# EAGLE schematic cpu (EAGLE 8.0.0)

## Sheet 1 of 3: Main Computer
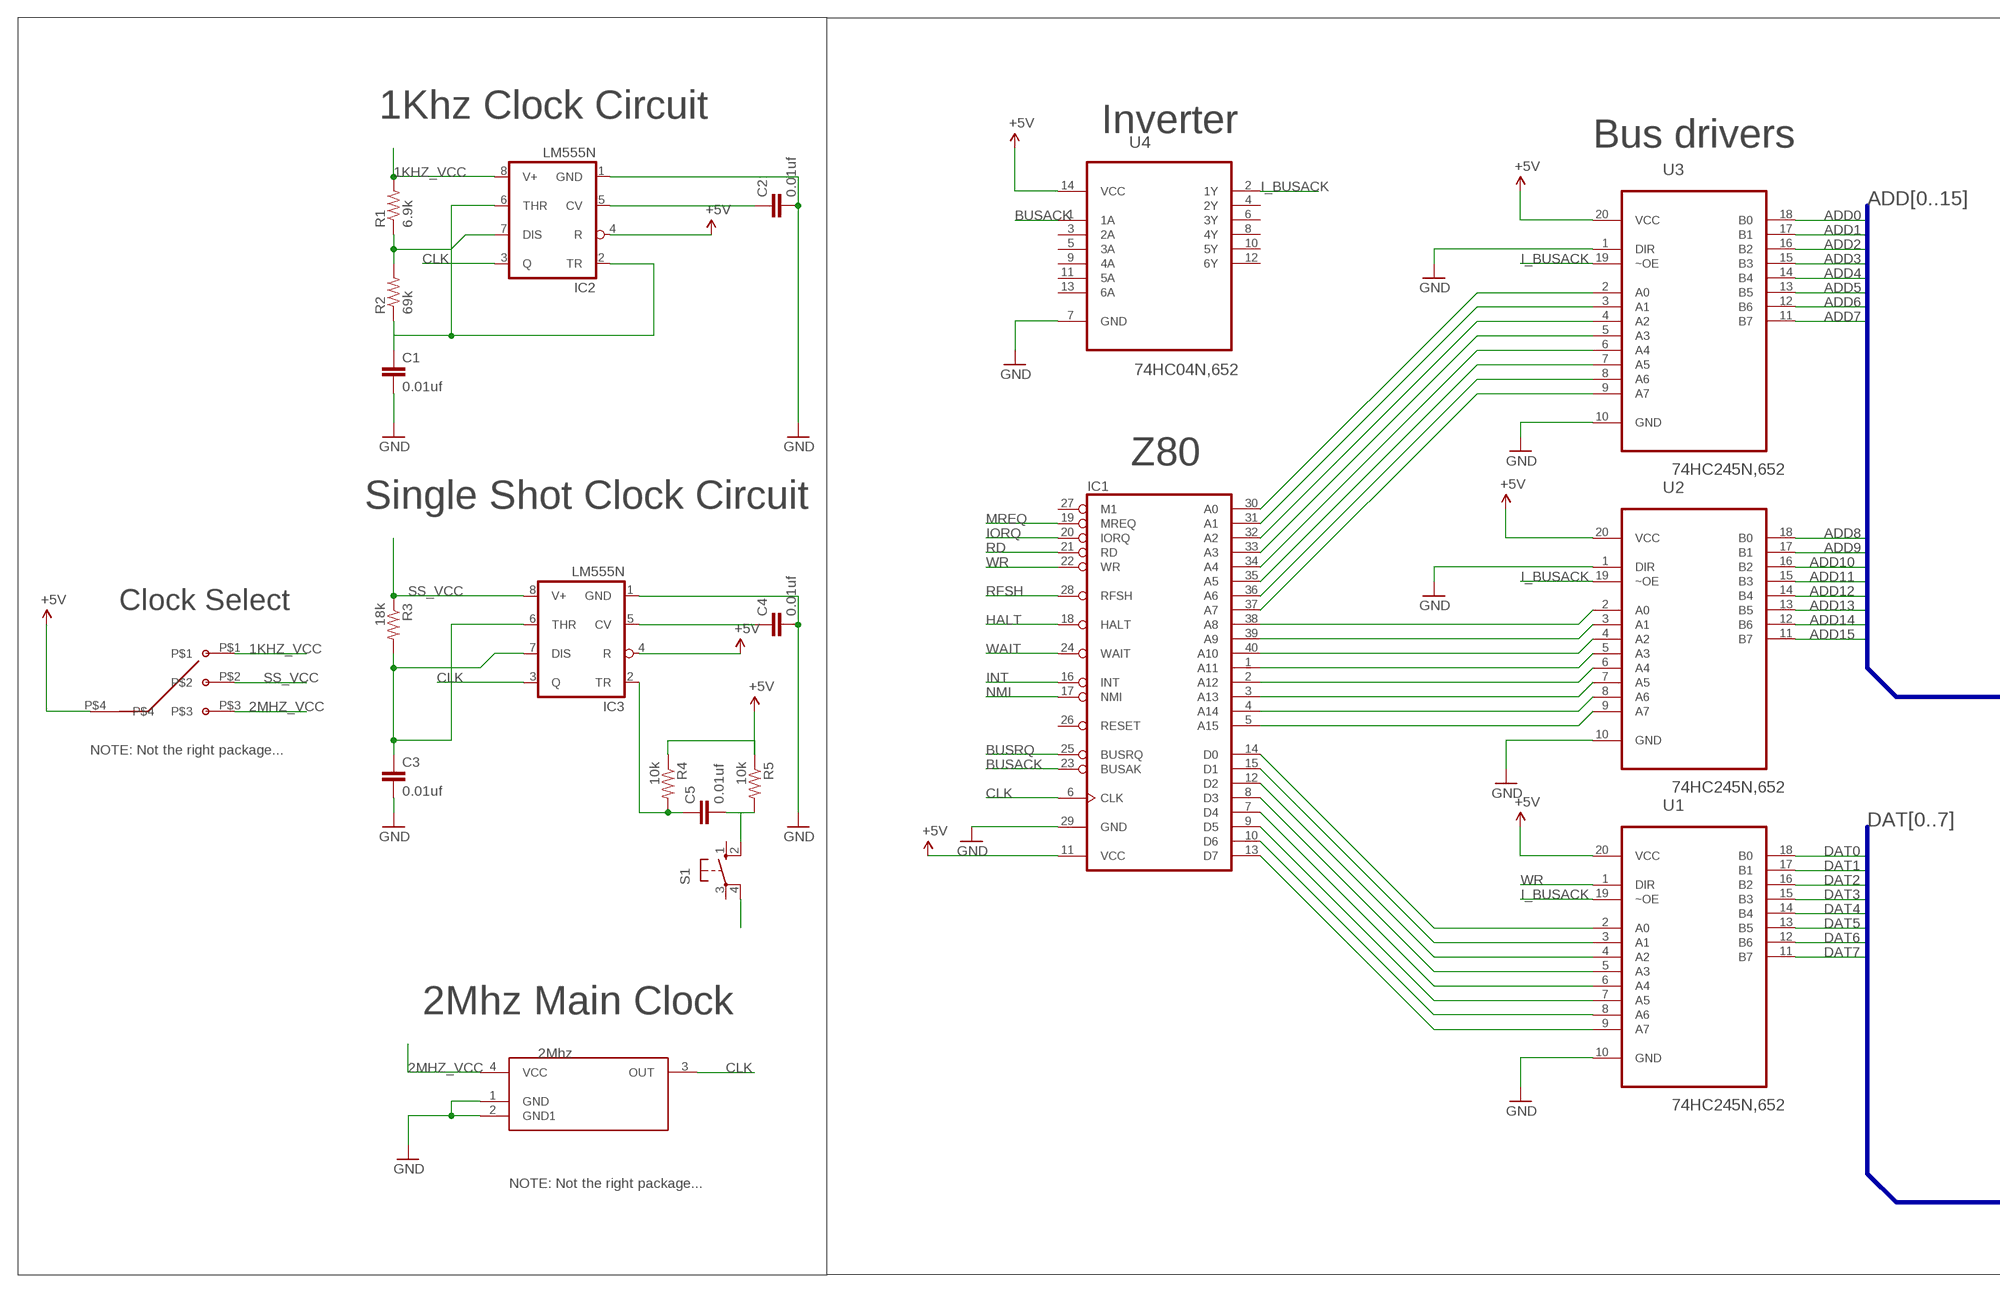
[diagram p0: schematic, sheet 1, part 1 of 2]
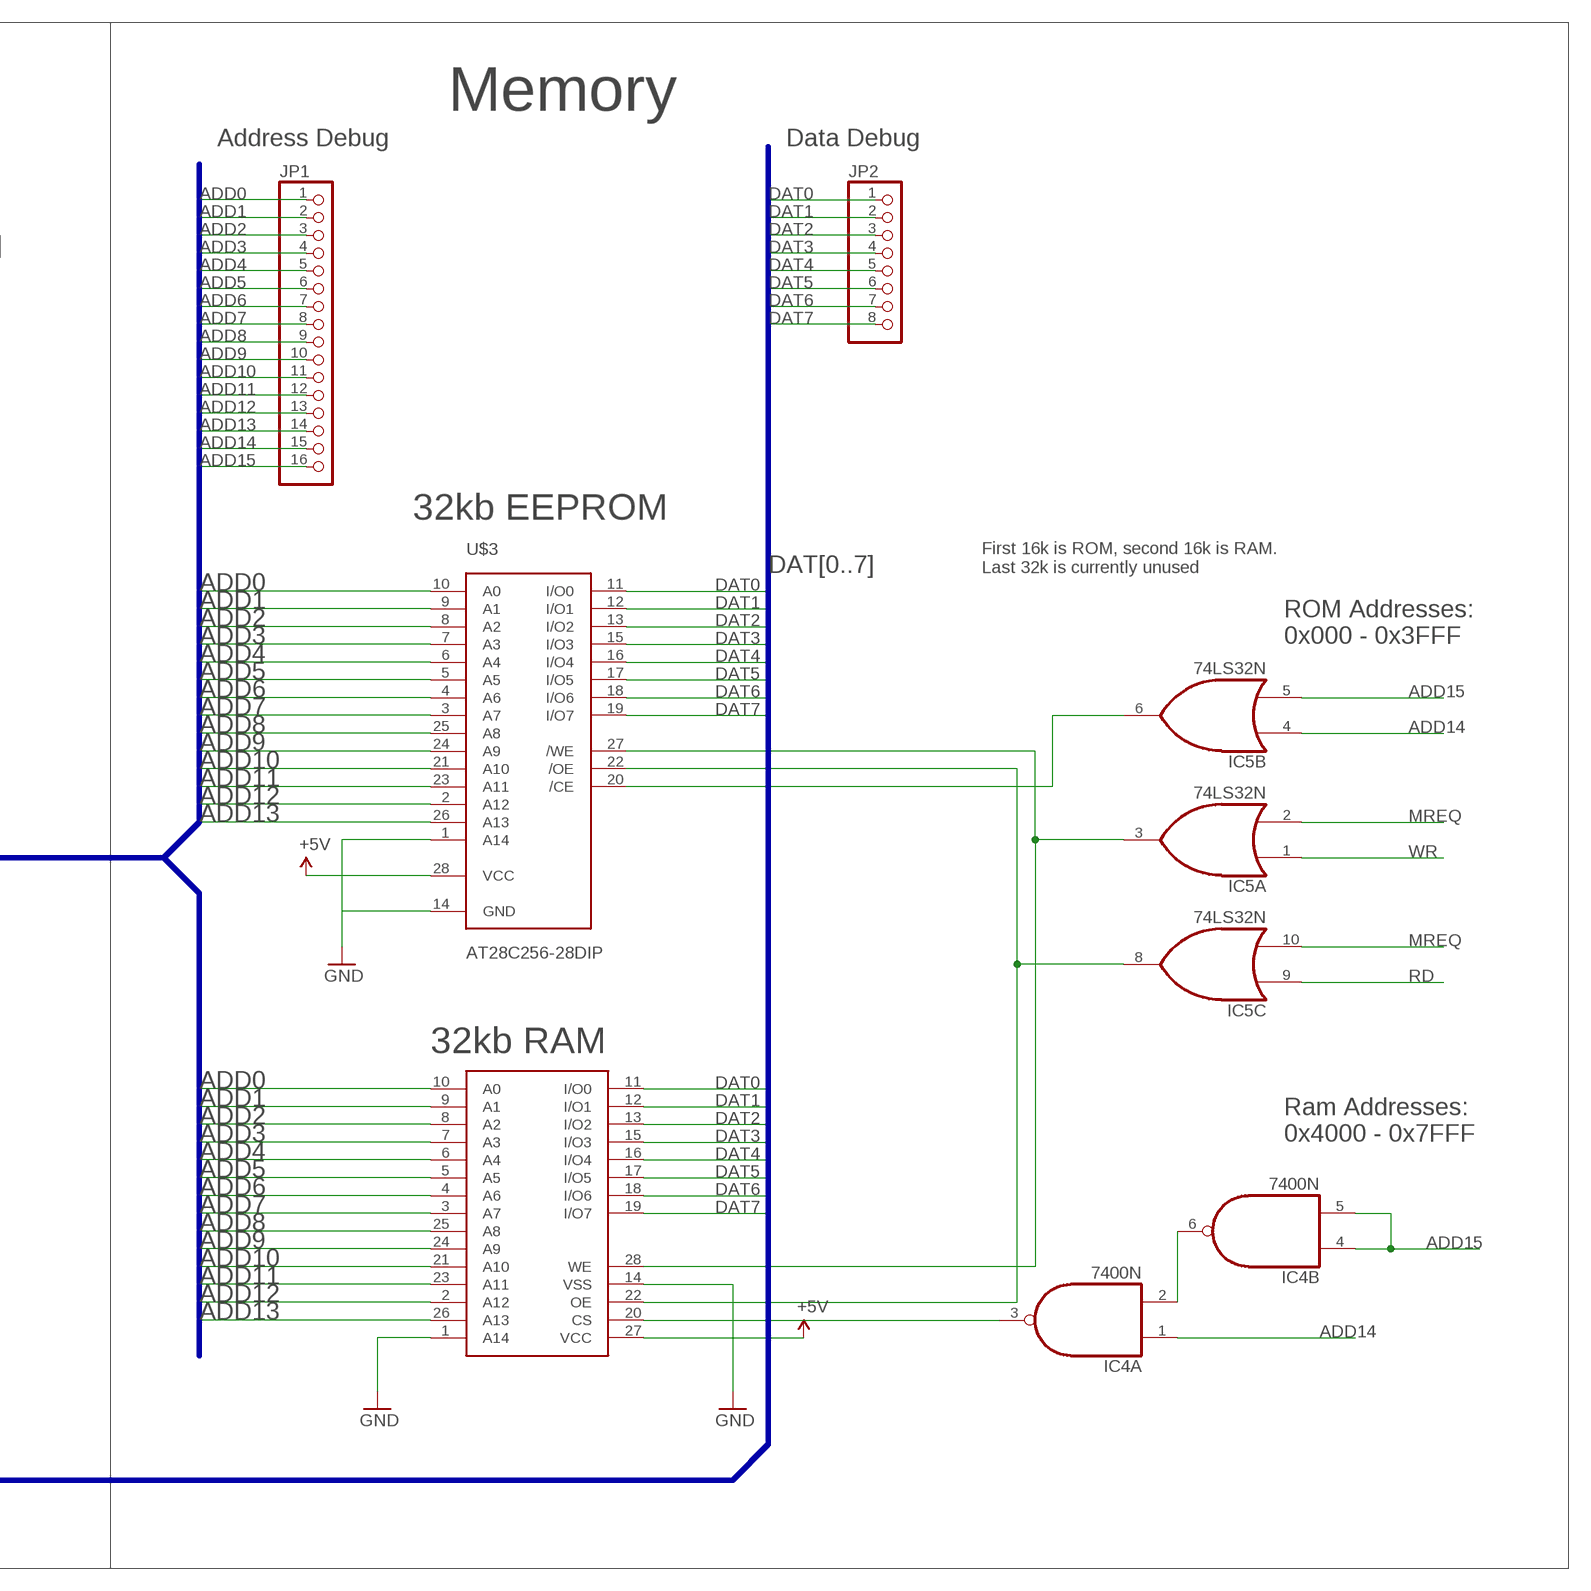
[diagram p1: schematic, sheet 1, part 2 of 2]

### Parts
C1  0.01uf  CAP0805  [0805]
C2  0.01uf  CAP0805  [0805]
C3  0.01uf  CAP0805  [0805]
C4  0.01uf  CAP0805  [0805]
C5  0.01uf  CAP0805  [0805]
IC1  Z80CPU  [DIL40]
IC2  LM555N  [DIL08]
IC3  LM555N  [DIL08]
IC4  7400N  [DIL14]
IC5  74LS32N  [DIL14]
JP1  PINHD-1X16  [1X16]
JP2  PINHD-1X8  [1X08]
R1  6.9k  RESISTOR0805-RES  [0805]
R2  69k  RESISTOR0805-RES  [0805]
R3  18k  RESISTOR0805-RES  [0805]
R4  10k  RESISTOR0805-RES  [0805]
R5  10k  RESISTOR0805-RES  [0805]
S1  10-XX  [B3F-10XX]
U1  74HC245N,652  [DIP254P762X420-20]
U2  74HC245N,652  [DIP254P762X420-20]
U3  74HC245N,652  [DIP254P762X420-20]
U4  74HC04N,652  [DIP254P762X420-14]
U$1  2Mhz  OSCILLATOR  [TSOT-23-6]
U$2  3SWITCH  [3SWITCH]
U$3  AT28C256-28DIP  [DIL28-6]
U$4  HM62256B  [DIL28-6]

### Nets
1KHZ_VCC: IC2.8(V+) R1.2 U$2.P$1
2MHZ_VCC: U$1.4(VCC) U$2.P$3
ADD0: JP1.1 U3.18(B0) U$3.10(A0) U$4.10(A0) ; also sheet 2
ADD1: JP1.2 U3.17(B1) U$3.9(A1) U$4.9(A1) ; also sheet 2
ADD2: JP1.3 U3.16(B2) U$3.8(A2) U$4.8(A2) ; also sheet 2
ADD3: JP1.4 U3.15(B3) U$3.7(A3) U$4.7(A3) ; also sheet 2
ADD4: JP1.5 U3.14(B4) U$3.6(A4) U$4.6(A4) ; also sheet 2
ADD5: JP1.6 U3.13(B5) U$3.5(A5) U$4.5(A5) ; also sheet 2
ADD6: JP1.7 U3.12(B6) U$3.4(A6) U$4.4(A6) ; also sheet 2
ADD7: JP1.8 U3.11(B7) U$3.3(A7) U$4.3(A7) ; also sheet 2
ADD8: JP1.9 U2.18(B0) U$3.25(A8) U$4.25(A8)
ADD9: JP1.10 U2.17(B1) U$3.24(A9) U$4.24(A9)
ADD10: JP1.11 U2.16(B2) U$3.21(A10) U$4.21(A10)
ADD11: JP1.12 U2.15(B3) U$3.23(A11) U$4.23(A11)
ADD12: JP1.13 U2.14(B4) U$3.2(A12) U$4.2(A12)
ADD13: JP1.14 U2.13(B5) U$3.26(A13) U$4.26(A13)
ADD14: IC4.1(A:I0) IC5.4(B:I0) JP1.15 U2.12(B6)
ADD15: IC4.4(B:I0) IC4.5(B:I1) IC5.5(B:I1) JP1.16 U2.11(B7)
BUSACK: IC1.23(BUSAK) U4.1(1A)
BUSRQ: IC1.25(BUSRQ)
CLK: IC1.6(CLK) IC2.3(Q) IC3.3(Q) U$1.3(OUT)
DAT0: JP2.1 U1.18(B0) U$3.11(I/O0) U$4.11(I/O0) ; also sheet 2
DAT1: JP2.2 U1.17(B1) U$3.12(I/O1) U$4.12(I/O1) ; also sheet 2
DAT2: JP2.3 U1.16(B2) U$3.13(I/O2) U$4.13(I/O2) ; also sheet 2
DAT3: JP2.4 U1.15(B3) U$3.15(I/O3) U$4.15(I/O3) ; also sheet 2
DAT4: JP2.5 U1.14(B4) U$3.16(I/O4) U$4.16(I/O4) ; also sheet 2
DAT5: JP2.6 U1.13(B5) U$3.17(I/O5) U$4.17(I/O5) ; also sheet 2
DAT6: JP2.7 U1.12(B6) U$3.18(I/O6) U$4.18(I/O6) ; also sheet 2
DAT7: JP2.8 U1.11(B7) U$3.19(I/O7) U$4.19(I/O7) ; also sheet 2
GND: C1.2 C2.2 C3.2 C4.2 IC1.29(GND) IC2.1(GND) IC3.1(GND) U1.10(GND) U2.1(DIR) U2.10(GND) U3.1(DIR) U3.10(GND) U4.7(GND) U$1.1(GND) U$1.2(GND1) U$3.1(A14) U$3.14(GND) U$4.1(A14) U$4.14(VSS) ; also sheet 2,3
HALT: IC1.18(HALT)
I_BUSACK: U1.19(~OE) U2.19(~OE) U3.19(~OE) U4.2(1Y)
INT: IC1.16(INT) ; also sheet 2
IORQ: IC1.20(IORQ) ; also sheet 2
MREQ: IC1.19(MREQ) IC5.2(A:I1) IC5.10(C:I1)
N$1: IC1.13(D7) U1.9(A7)
N$2: IC1.10(D6) U1.8(A6)
N$3: IC1.9(D5) U1.7(A5)
N$4: IC1.7(D4) U1.6(A4)
N$5: IC1.8(D3) U1.5(A3)
N$6: IC1.12(D2) U1.4(A2)
N$7: IC1.15(D1) U1.3(A1)
N$8: IC1.14(D0) U1.2(A0)
N$9: IC1.5(A15) U2.9(A7)
N$10: IC1.4(A14) U2.8(A6)
N$11: IC1.3(A13) U2.7(A5)
N$12: IC1.2(A12) U2.6(A4)
N$13: IC1.1(A11) U2.5(A3)
N$14: IC1.40(A10) U2.4(A2)
N$15: IC1.39(A9) U2.3(A1)
N$16: IC1.38(A8) U2.2(A0)
N$17: IC1.32(A2) U3.4(A2)
N$18: IC1.30(A0) U3.2(A0)
N$19: IC1.31(A1) U3.3(A1)
N$20: IC1.33(A3) U3.5(A3)
N$21: IC1.34(A4) U3.6(A4)
N$22: IC1.35(A5) U3.7(A5)
N$23: IC1.37(A7) U3.9(A7)
N$24: IC1.36(A6) U3.8(A6)
N$25: IC2.7(DIS) R1.1 R2.2
N$26: C1.1 IC2.2(TR) IC2.6(THR) R2.1
N$27: C4.1 IC3.5(CV)
N$28: C2.1 IC2.5(CV)
N$29: C3.1 IC3.6(THR) IC3.7(DIS) R3.2
N$30: C5.1 IC3.2(TR) R4.2
N$31: C5.2 R5.2 S1.2(S1)
N$32: IC5.6(B:O) U$3.20(/CE)
N$33: S1.4(P1)
N$34: IC5.3(A:O) U$3.27(/WE) U$4.28(WE)
N$35: IC5.8(C:O) U$3.22(/OE) U$4.22(OE)
N$36: IC4.3(A:O) U$4.20(CS)
N$37: IC4.2(A:I1) IC4.6(B:O)
NMI: IC1.17(NMI)
RD: IC1.21(RD) IC5.9(C:I0) ; also sheet 2
RFSH: IC1.28(RFSH)
SS_VCC: IC3.8(V+) R3.1 U$2.P$2
VCC: IC1.11(VCC) IC2.4(R) IC3.4(R) R4.1 R5.1 U1.20(VCC) U2.20(VCC) U3.20(VCC) U4.14(VCC) U$2.P$4 U$3.28(VCC) U$4.27(VCC) ; supply symbol labelled +5V ; also sheet 2
WAIT: IC1.24(WAIT)
WR: IC1.22(WR) IC5.1(A:I0) U1.1(DIR) ; also sheet 2
Unconnected: IC1.26(RESET) IC1.27(M1) IC4.8(C:O) IC4.9(C:I0) IC4.10(C:I1) IC4.11(D:O) IC4.12(D:I0) IC4.13(D:I1) IC5.11(D:O) IC5.12(D:I0) IC5.13(D:I1) S1.1(S) S1.3(P) U4.3(2A) U4.4(2Y) U4.5(3A) U4.6(3Y) U4.8(4Y) U4.9(4A) U4.10(5Y) U4.11(5A) U4.12(6Y) U4.13(6A)

### Buses
ADD[0..15]
DAT[0..7]

### Notes on the sheet
- Memory
- 1Khz Clock Circuit | Address Debug | Data Debug
- Inverter
- Bus drivers
- 32kb EEPROM
- Z80
- First 16k is ROM, second 16k is RAM.
  Last 32k is currently unused
- Single Shot Clock Circuit
- ROM Addresses:
  0x000 - 0x3FFF
- Clock Select
- NOTE: Not the right package...
- 32kb RAM
- Ram Addresses:
  0x4000 - 0x7FFF
- 2Mhz Main Clock
- 2Mhz
- NOTE: Not the right package...

## Sheet 2 of 3: Input Output
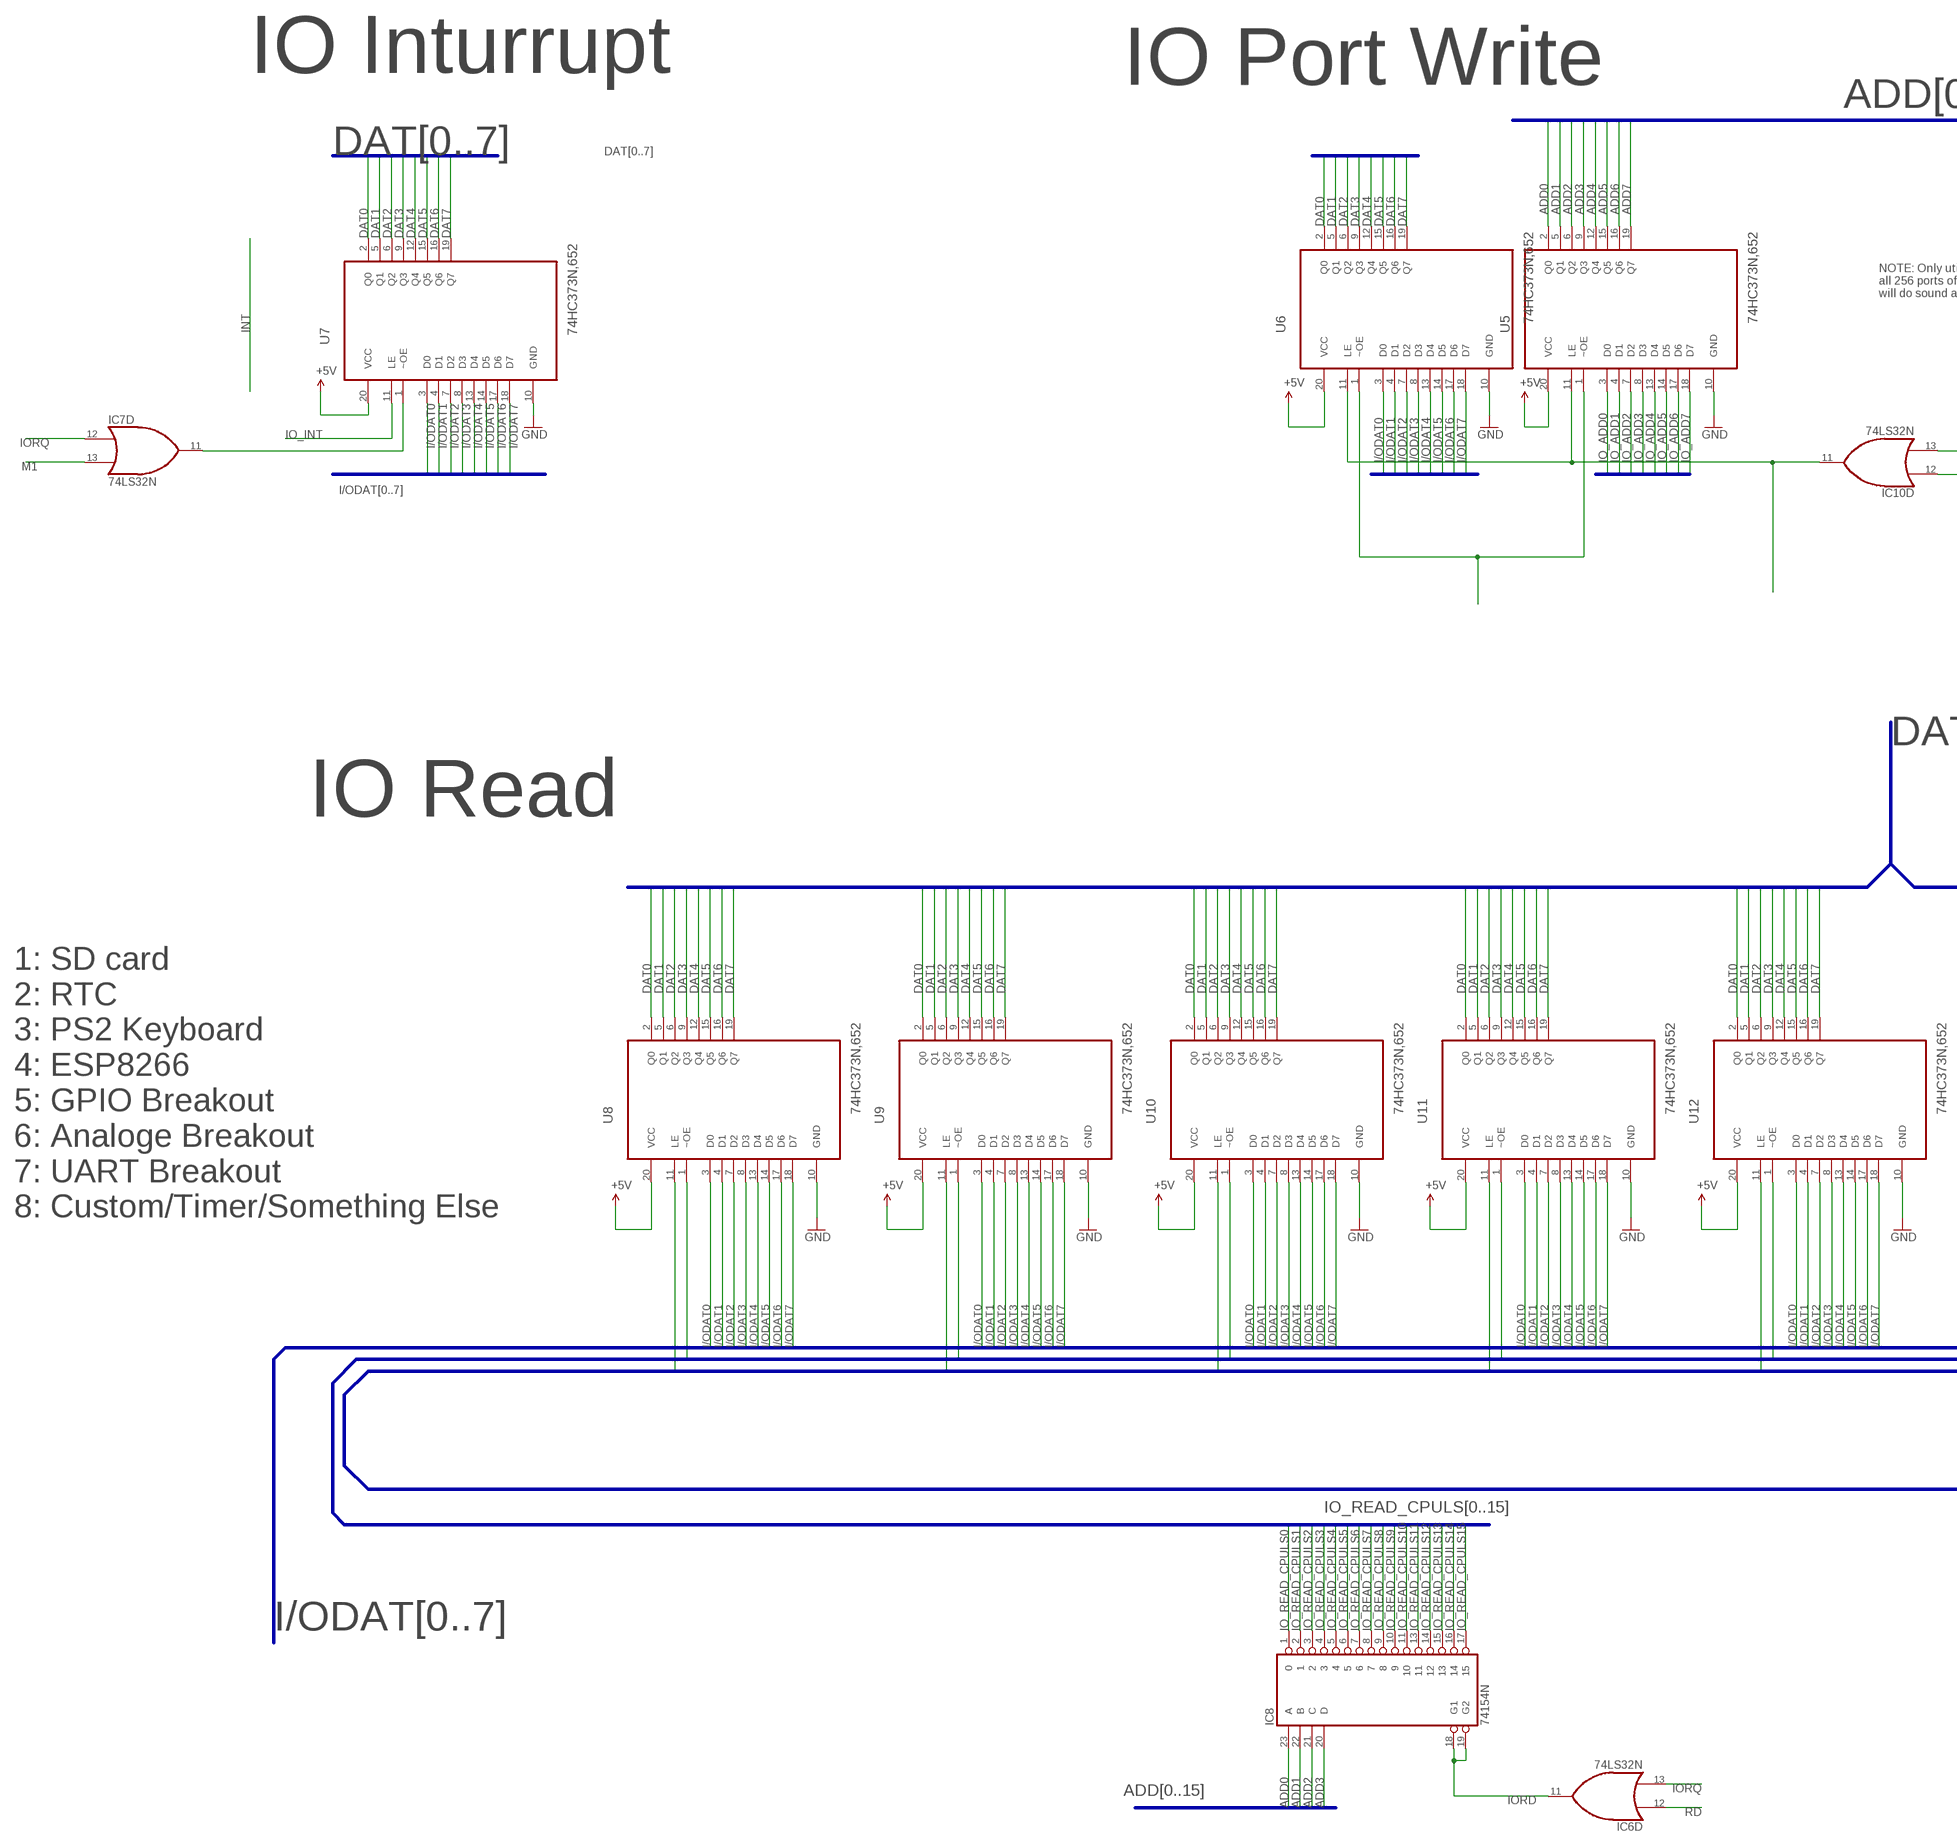
[diagram p2: schematic, sheet 2, part 1 of 2]
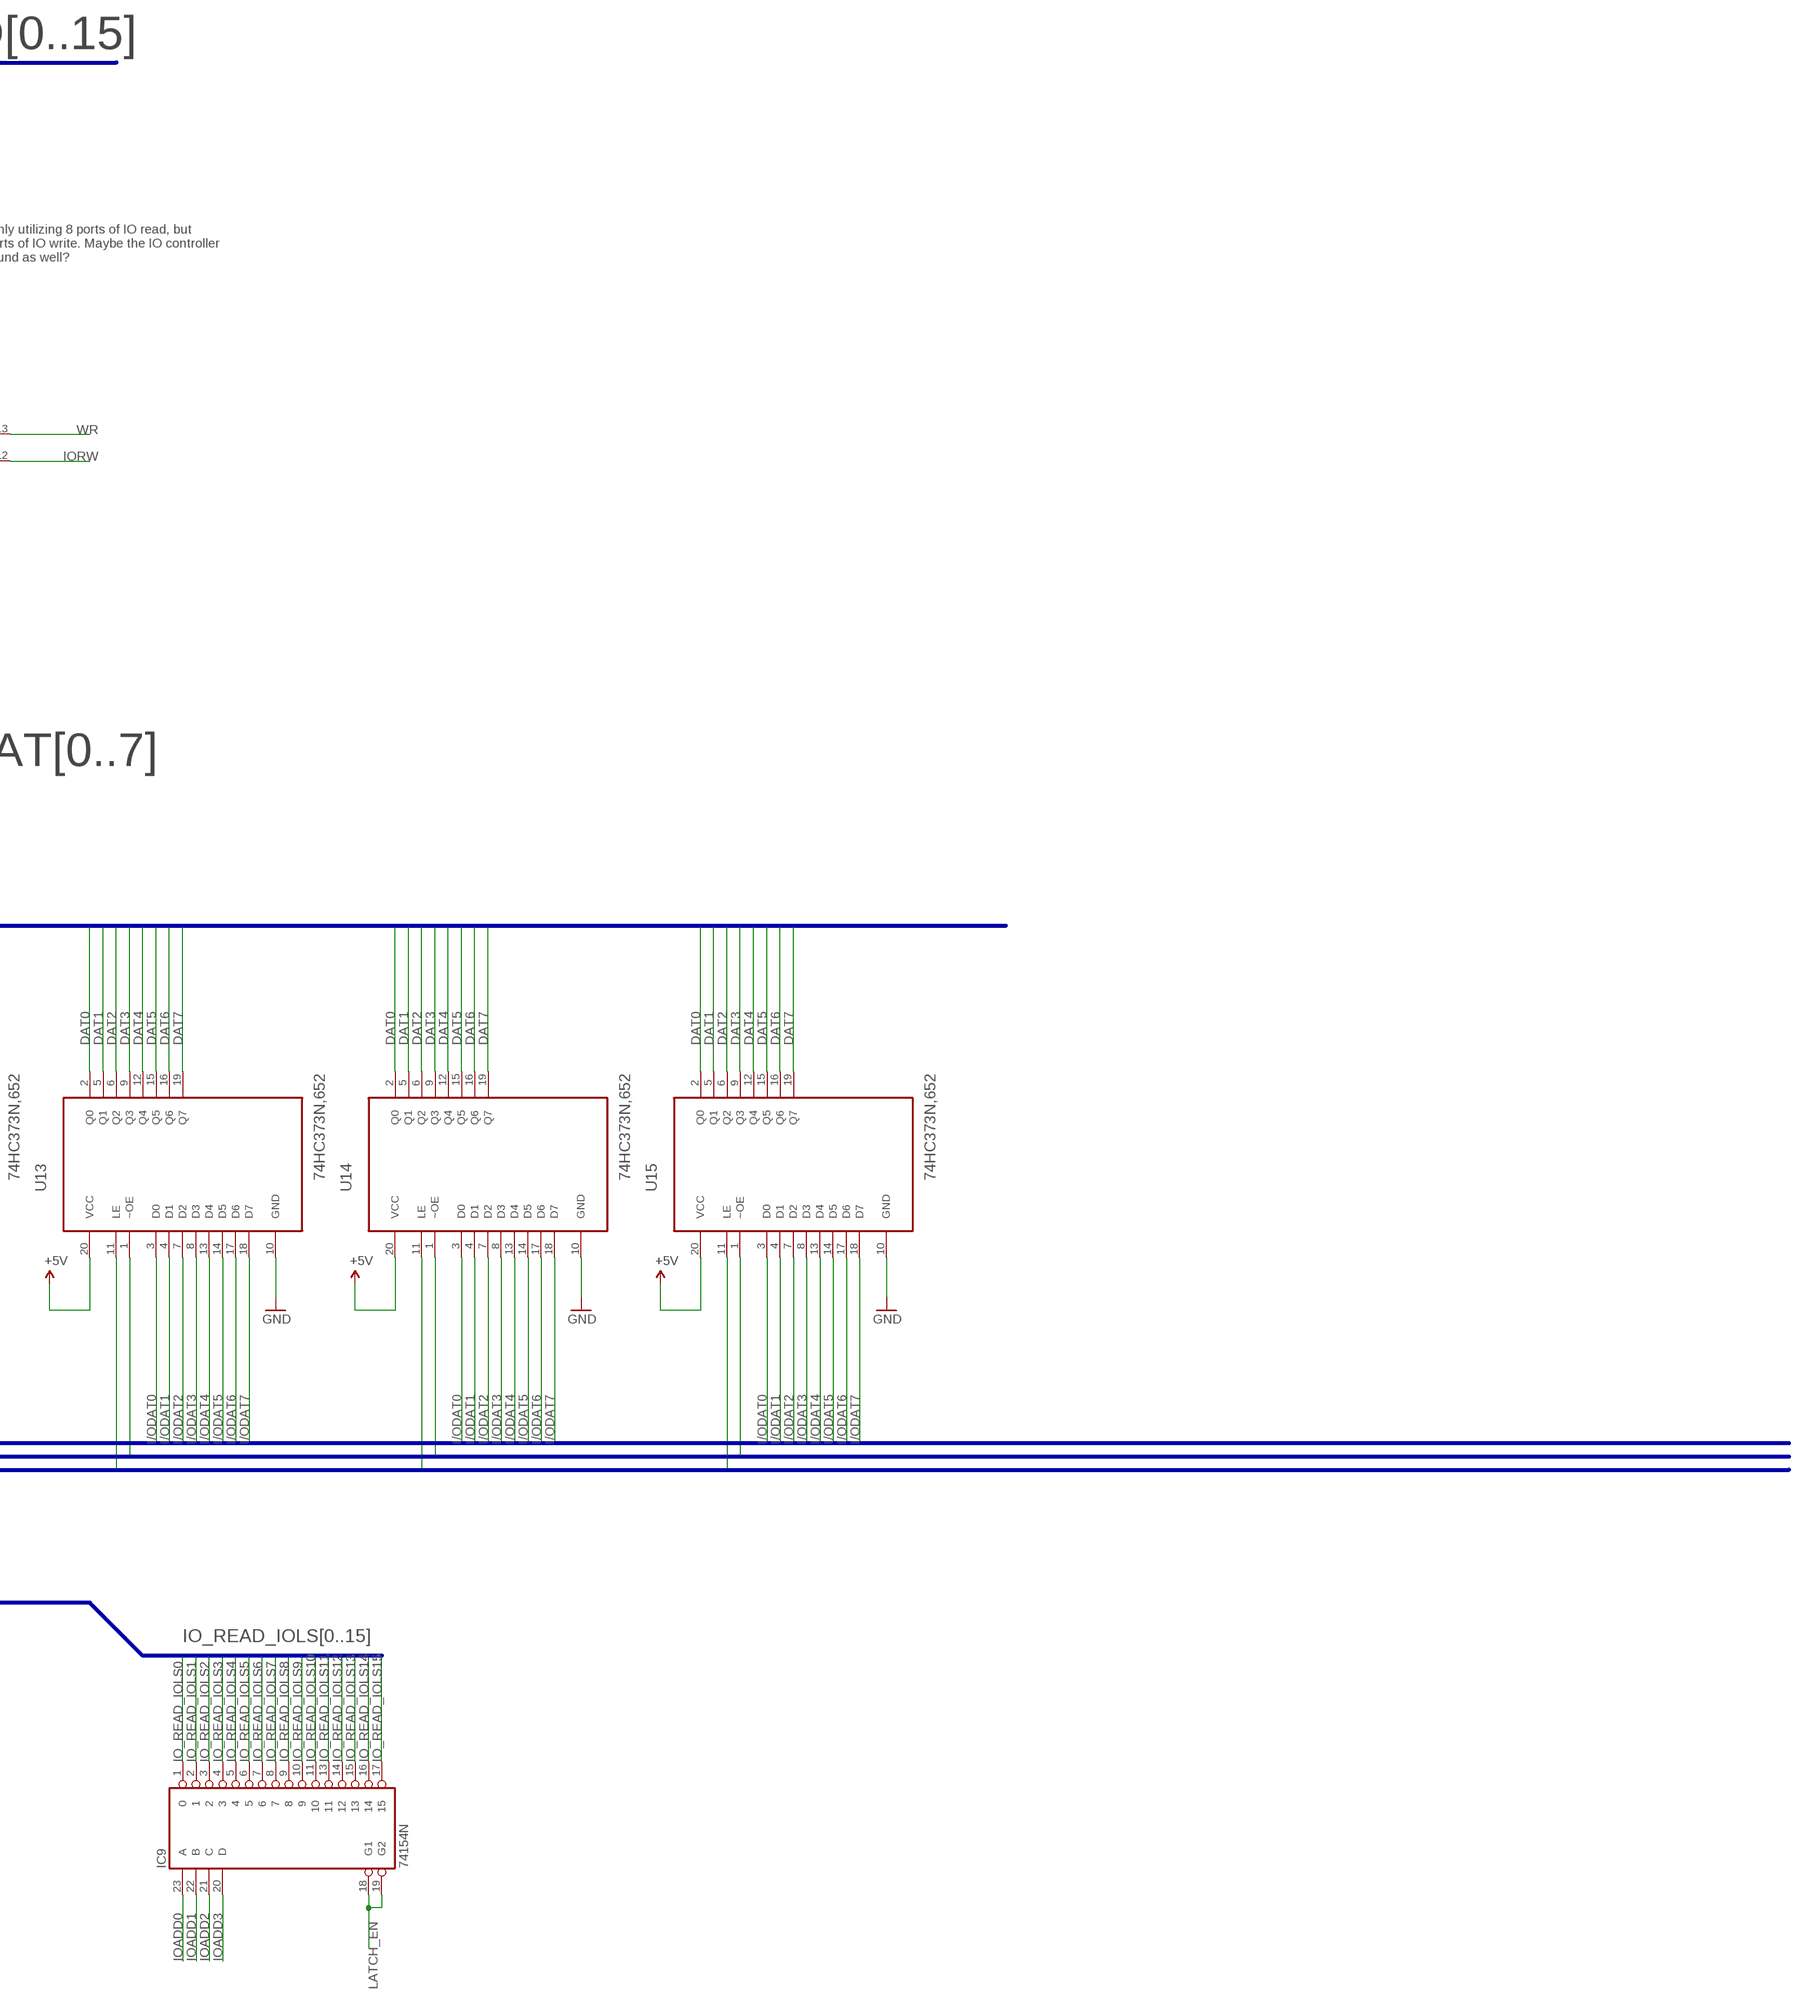
[diagram p3: schematic, sheet 2, part 2 of 2]

### Parts
IC6  74LS32N  [DIL14]
IC7  74LS32N  [DIL14]
IC8  74154N  [DIL24-6]
IC9  74154N  [DIL24-6]
IC10  74LS32N  [DIL14]
U5  74HC373N,652  [DIP254P762X420-20]
U6  74HC373N,652  [DIP254P762X420-20]
U7  74HC373N,652  [DIP254P762X420-20]
U8  74HC373N,652  [DIP254P762X420-20]
U9  74HC373N,652  [DIP254P762X420-20]
U10  74HC373N,652  [DIP254P762X420-20]
U11  74HC373N,652  [DIP254P762X420-20]
U12  74HC373N,652  [DIP254P762X420-20]
U13  74HC373N,652  [DIP254P762X420-20]
U14  74HC373N,652  [DIP254P762X420-20]
U15  74HC373N,652  [DIP254P762X420-20]

### Nets
5V: U7.20(VCC) ; supply symbol labelled +5V ; also sheet 3
ADD0: IC8.23(A) U5.2(Q0) ; also sheet 1
ADD1: IC8.22(B) U5.5(Q1) ; also sheet 1
ADD2: IC8.21(C) U5.6(Q2) ; also sheet 1
ADD3: IC8.20(D) U5.9(Q3) ; also sheet 1
ADD4: U5.12(Q4) ; also sheet 1
ADD5: U5.15(Q5) ; also sheet 1
ADD6: U5.16(Q6) ; also sheet 1
ADD7: U5.19(Q7) ; also sheet 1
DAT0: U6.2(Q0) U7.2(Q0) U8.2(Q0) U9.2(Q0) U10.2(Q0) U11.2(Q0) U12.2(Q0) U13.2(Q0) U14.2(Q0) U15.2(Q0) ; also sheet 1
DAT1: U6.5(Q1) U7.5(Q1) U8.5(Q1) U9.5(Q1) U10.5(Q1) U11.5(Q1) U12.5(Q1) U13.5(Q1) U14.5(Q1) U15.5(Q1) ; also sheet 1
DAT2: U6.6(Q2) U7.6(Q2) U8.6(Q2) U9.6(Q2) U10.6(Q2) U11.6(Q2) U12.6(Q2) U13.6(Q2) U14.6(Q2) U15.6(Q2) ; also sheet 1
DAT3: U6.9(Q3) U7.9(Q3) U8.9(Q3) U9.9(Q3) U10.9(Q3) U11.9(Q3) U12.9(Q3) U13.9(Q3) U14.9(Q3) U15.9(Q3) ; also sheet 1
DAT4: U6.12(Q4) U7.12(Q4) U8.12(Q4) U9.12(Q4) U10.12(Q4) U11.12(Q4) U12.12(Q4) U13.12(Q4) U14.12(Q4) U15.12(Q4) ; also sheet 1
DAT5: U6.15(Q5) U7.15(Q5) U8.15(Q5) U9.15(Q5) U10.15(Q5) U11.15(Q5) U12.15(Q5) U13.15(Q5) U14.15(Q5) U15.15(Q5) ; also sheet 1
DAT6: U6.16(Q6) U7.16(Q6) U8.16(Q6) U9.16(Q6) U10.16(Q6) U11.16(Q6) U12.16(Q6) U13.16(Q6) U14.16(Q6) U15.16(Q6) ; also sheet 1
DAT7: U6.19(Q7) U7.19(Q7) U8.19(Q7) U9.19(Q7) U10.19(Q7) U11.19(Q7) U12.19(Q7) U13.19(Q7) U14.19(Q7) U15.19(Q7) ; also sheet 1
GND: U5.10(GND) U6.10(GND) U7.10(GND) U8.10(GND) ; also sheet 1,3
I/ODAT0: U6.3(D0) U7.3(D0) U8.3(D0) U9.3(D0) U10.3(D0) U11.3(D0) U12.3(D0) U13.3(D0) U14.3(D0) U15.3(D0)
I/ODAT1: U6.4(D1) U7.4(D1) U8.4(D1) U9.4(D1) U10.4(D1) U11.4(D1) U12.4(D1) U13.4(D1) U14.4(D1) U15.4(D1)
I/ODAT2: U6.7(D2) U7.7(D2) U8.7(D2) U9.7(D2) U10.7(D2) U11.7(D2) U12.7(D2) U13.7(D2) U14.7(D2) U15.7(D2)
I/ODAT3: U6.8(D3) U7.8(D3) U8.8(D3) U9.8(D3) U10.8(D3) U11.8(D3) U12.8(D3) U13.8(D3) U14.8(D3) U15.8(D3)
I/ODAT4: U6.13(D4) U7.13(D4) U8.13(D4) U9.13(D4) U10.13(D4) U11.13(D4) U12.13(D4) U13.13(D4) U14.13(D4) U15.13(D4)
I/ODAT5: U6.14(D5) U7.14(D5) U8.14(D5) U9.14(D5) U10.14(D5) U11.14(D5) U12.14(D5) U13.14(D5) U14.14(D5) U15.14(D5)
I/ODAT6: U6.17(D6) U7.17(D6) U8.17(D6) U9.17(D6) U10.17(D6) U11.17(D6) U12.17(D6) U13.17(D6) U14.17(D6) U15.17(D6)
I/ODAT7: U6.18(D7) U7.18(D7) U8.18(D7) U9.18(D7) U10.18(D7) U11.18(D7) U12.18(D7) U13.18(D7) U14.18(D7) U15.18(D7)
IO_ADD0: U5.3(D0)
IO_ADD1: U5.4(D1)
IO_ADD2: U5.7(D2)
IO_ADD3: U5.8(D3)
IO_ADD4: U5.13(D4)
IO_ADD5: U5.14(D5)
IO_ADD6: U5.17(D6)
IO_ADD7: U5.18(D7)
IO_INT: U7.11(LE)
IO_READ_CPULS0: IC8.1 U8.1(~OE)
IO_READ_CPULS1: IC8.2 U9.1(~OE)
IO_READ_CPULS2: IC8.3 U10.1(~OE)
IO_READ_CPULS3: IC8.4 U11.1(~OE)
IO_READ_CPULS4: IC8.5 U12.1(~OE)
IO_READ_CPULS5: IC8.6 U13.1(~OE)
IO_READ_CPULS6: IC8.7 U14.1(~OE)
IO_READ_CPULS7: IC8.8 U15.1(~OE)
IO_READ_CPULS8: IC8.9
IO_READ_CPULS9: IC8.10
IO_READ_CPULS10: IC8.11
IO_READ_CPULS11: IC8.13
IO_READ_CPULS12: IC8.14
IO_READ_CPULS13: IC8.15
IO_READ_CPULS14: IC8.16
IO_READ_CPULS15: IC8.17
IO_READ_IOLS0: IC9.1 U8.11(LE)
IO_READ_IOLS1: IC9.2 U9.11(LE)
IO_READ_IOLS2: IC9.3 U10.11(LE)
IO_READ_IOLS3: IC9.4 U11.11(LE)
IO_READ_IOLS4: IC9.5 U12.11(LE)
IO_READ_IOLS5: IC9.6 U13.11(LE)
IO_READ_IOLS6: IC9.7 U14.11(LE)
IO_READ_IOLS7: IC9.8 U15.11(LE)
IO_READ_IOLS8: IC9.9
IO_READ_IOLS9: IC9.10
IO_READ_IOLS10: IC9.11
IO_READ_IOLS11: IC9.13
IO_READ_IOLS12: IC9.14
IO_READ_IOLS13: IC9.15
IO_READ_IOLS14: IC9.16
IO_READ_IOLS15: IC9.17
IOADD0: IC9.23(A)
IOADD1: IC9.22(B)
IOADD2: IC9.21(C)
IOADD3: IC9.20(D)
IORD: IC6.11(D:O) IC8.18(G1) IC8.19(G2)
IORQ: IC6.13(D:I1) IC7.12(D:I0) ; also sheet 1
IORW: IC10.12(D:I0)
LATCH_EN: IC9.18(G1) IC9.19(G2)
M1: IC7.13(D:I1)
N$38: IC7.11(D:O) U7.1(~OE)
N$39: IC10.11(D:O) U5.11(LE) U6.11(LE)
N$40: U5.1(~OE) U6.1(~OE)
RD: IC6.12(D:I0) ; also sheet 1
VCC: U5.20(VCC) U6.20(VCC) U8.20(VCC) ; supply symbol labelled +5V ; also sheet 1
WR: IC10.13(D:I1) ; also sheet 1
Unconnected: IC6.1(A:I0) IC6.2(A:I1) IC6.3(A:O) IC6.4(B:I0) IC6.5(B:I1) IC6.6(B:O) IC6.8(C:O) IC6.9(C:I0) IC6.10(C:I1) IC7.1(A:I0) IC7.2(A:I1) IC7.3(A:O) IC7.4(B:I0) IC7.5(B:I1) IC7.6(B:O) IC7.8(C:O) IC7.9(C:I0) IC7.10(C:I1) IC10.1(A:I0) IC10.2(A:I1) IC10.3(A:O) IC10.4(B:I0) IC10.5(B:I1) IC10.6(B:O) IC10.8(C:O) IC10.9(C:I0) IC10.10(C:I1) U9.10(GND) U10.10(GND) U11.10(GND) U12.10(GND) U13.10(GND) U14.10(GND) U15.10(GND)

### Buses
ADD[0..15]
DAT[0..7]
I/ODAT[0..7]
IO_READ_IOLS[0..15]
IO_READ_CPULS[0..15]
IO_ADD[0..8]

### Notes on the sheet
- IO Inturrupt | IO Port Write
- NOTE: Only utilizing 8 ports of IO read, but 
  all 256 ports of IO write. Maybe the IO controller
  will do sound as well?
- IO Read
- 1: SD card
  2: RTC
  3: PS2 Keyboard
  4: ESP8266
  5: GPIO Breakout
  6: Analoge Breakout
  7: UART Breakout
  8: Custom/Timer/Something Else

## Sheet 3 of 3: VGA Video Generator
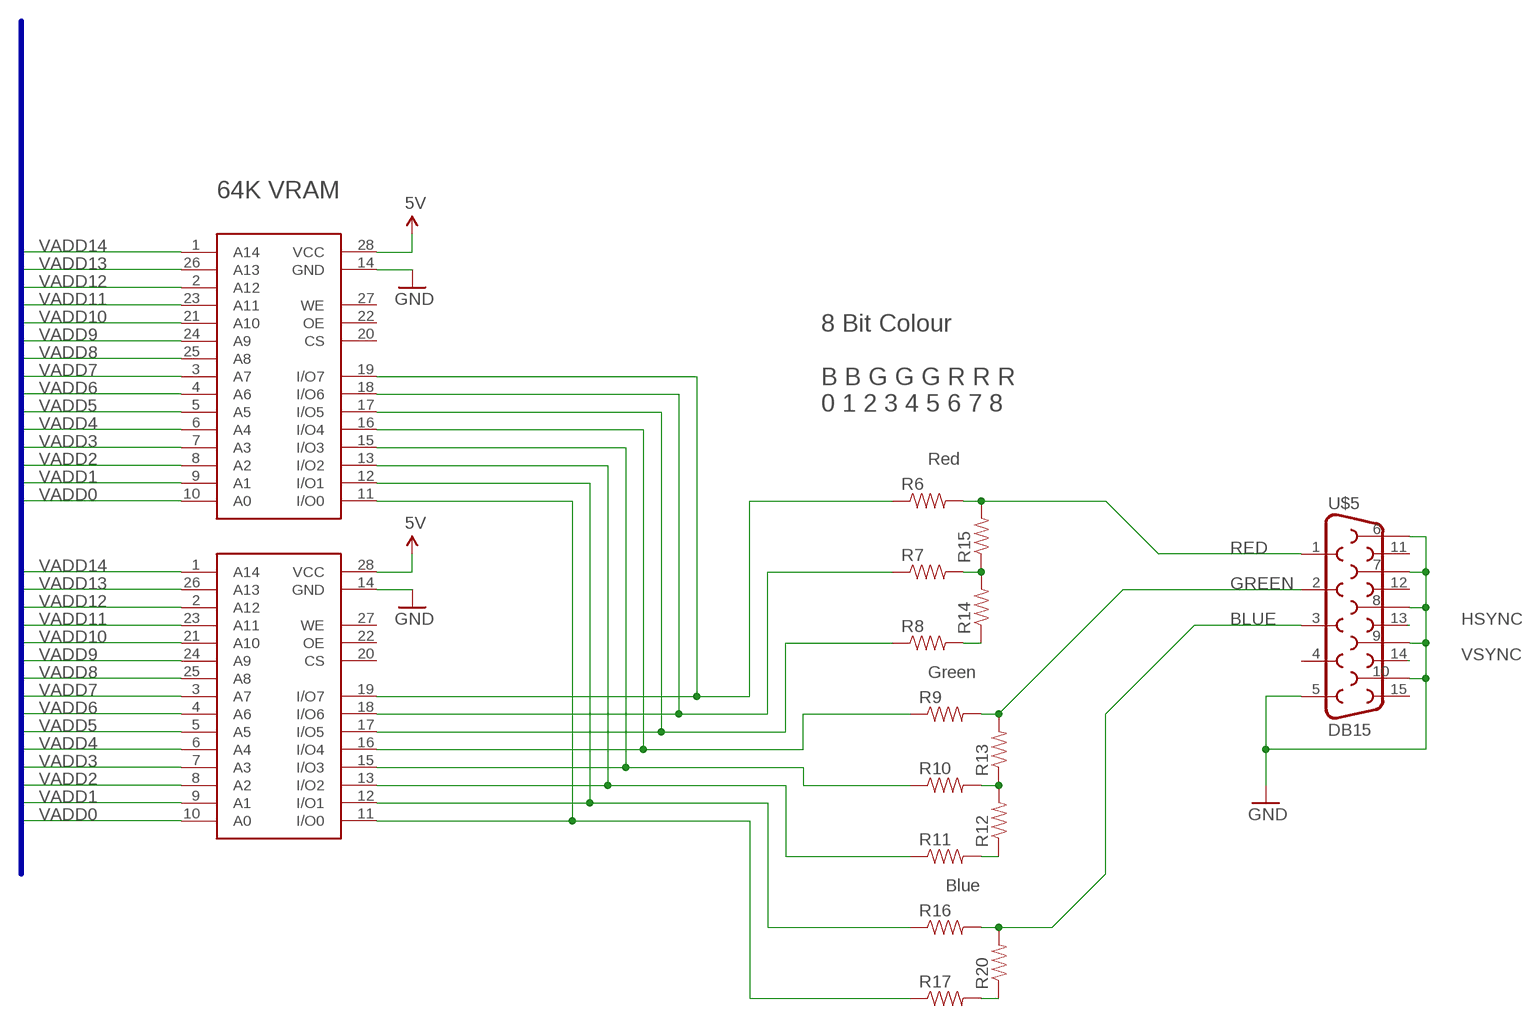
[diagram p4: schematic, sheet 3]

### Parts
R6  RESISTORPTH-1/4W  [AXIAL-0.4]
R7  RESISTORPTH-1/4W  [AXIAL-0.4]
R8  RESISTORPTH-1/4W  [AXIAL-0.4]
R9  RESISTORPTH-1/4W  [AXIAL-0.4]
R10  RESISTORPTH-1/4W  [AXIAL-0.4]
R11  RESISTORPTH-1/4W  [AXIAL-0.4]
R12  RESISTORPTH-1/4W  [AXIAL-0.4]
R13  RESISTORPTH-1/4W  [AXIAL-0.4]
R14  RESISTORPTH-1/4W  [AXIAL-0.4]
R15  RESISTORPTH-1/4W  [AXIAL-0.4]
R16  RESISTORPTH-1/4W  [AXIAL-0.4]
R17  RESISTORPTH-1/4W  [AXIAL-0.4]
R20  RESISTORPTH-1/4W  [AXIAL-0.4]
U$5  DB15  [DB15]
U$6  IDT71256SA  [DIL28-3]
U$7  IDT71256SA  [DIL28-3]

### Nets
5V: U$6.28(VCC) U$7.28(VCC) ; also sheet 2
BLUE: R16.P$2 R20.P$2 U$5.3
GND: U$5.5 U$5.6 U$5.7 U$5.8 U$5.9 U$5.10 U$6.14(GND) U$7.14(GND) ; also sheet 1,2
GREEN: R9.P$2 R13.P$2 U$5.2
HSYNC: U$5.13
N$41: R17.P$1 U$6.11(I/O0) U$7.11(I/O0)
N$42: R16.P$1 U$6.12(I/O1) U$7.12(I/O1)
N$43: R11.P$1 U$6.13(I/O2) U$7.13(I/O2)
N$44: R10.P$1 U$6.15(I/O3) U$7.15(I/O3)
N$45: R9.P$1 U$6.16(I/O4) U$7.16(I/O4)
N$46: R8.P$1 U$6.17(I/O5) U$7.17(I/O5)
N$47: R7.P$1 U$6.18(I/O6) U$7.18(I/O6)
N$48: R6.P$1 U$6.19(I/O7) U$7.19(I/O7)
N$49: R8.P$2 R14.P$1
N$52: R7.P$2 R14.P$2 R15.P$1
N$56: R11.P$2 R12.P$1
N$57: R10.P$2 R12.P$2 R13.P$1
N$62: R17.P$2 R20.P$1
RED: R6.P$2 R15.P$2 U$5.1
VADD0: U$6.10(A0) U$7.10(A0)
VADD1: U$6.9(A1) U$7.9(A1)
VADD2: U$6.8(A2) U$7.8(A2)
VADD3: U$6.7(A3) U$7.7(A3)
VADD4: U$6.6(A4) U$7.6(A4)
VADD5: U$6.5(A5) U$7.5(A5)
VADD6: U$6.4(A6) U$7.4(A6)
VADD7: U$6.3(A7) U$7.3(A7)
VADD8: U$6.25(A8) U$7.25(A8)
VADD9: U$6.24(A9) U$7.24(A9)
VADD10: U$6.21(A10) U$7.21(A10)
VADD11: U$6.23(A11) U$7.23(A11)
VADD12: U$6.2(A12) U$7.2(A12)
VADD13: U$6.26(A13) U$7.26(A13)
VADD14: U$6.1(A14) U$7.1(A14)
VSYNC: U$5.14
Unconnected: U$5.4 U$5.11 U$5.12 U$5.15 U$6.20(CS) U$6.22(OE) U$6.27(WE) U$7.20(CS) U$7.22(OE) U$7.27(WE)

### Buses
VADD[0..14]

### Notes on the sheet
- 64K VRAM
- 8 Bit Colour
  
  B B G G G R R R
  0 1 2 3 4 5 6 7 8
- Red
- Green
- Blue

## Power pins joined to a net without a drawn wire
GND: IC4.7(P:GND) IC5.7(P:GND) IC6.7(P:GND) IC7.7(P:GND) IC8.12(GND) IC9.12(GND) IC10.7(P:GND)
VCC: IC4.14(P:VCC) IC5.14(P:VCC) IC6.14(P:VCC) IC7.14(P:VCC) IC8.24(VCC) IC9.24(VCC) IC10.14(P:VCC) U9.20(VCC) U10.20(VCC) U11.20(VCC) U12.20(VCC) U13.20(VCC) U14.20(VCC) U15.20(VCC)

## Library data of the parts
C1-C5 = SparkFun-Capacitors:CAP: Capacitor Standard 0603 ceramic capacitor, and 0.1" leaded capacitor.
IC1 = zilog:Z80CPU: Z80 FAMILY DEVICE
IC2 IC3 = linear:*555: TIMER
IC4 = 74xx-us:74*00: Quad 2-input NAND gate
IC5-IC7 IC10 = 74xx-us:74*32: Quad 2-input OR gate
IC8 IC9 = 74xx-us:74*154: 4-line to 16-line data SELECTOR/MULTIPLEXER
JP1 = pinhead:PINHD-1X16: PIN HEADER
JP2 = pinhead:PINHD-1X8: PIN HEADER
R1-R17 R20 = SparkFun-Resistors:RESISTOR: Resistor Basic schematic elements and footprints for 0603, 1206, and PTH resistors.
S1 = switch-omron:10-XX: OMRON SWITCH; MPN: B3F-1000; OC_FARNELL: 176432; OC_NEWARK: 36M3542
U1-U3 = NXP_By_element14_Batch_1:74HC245N,652: Octal bus tranceiver 3-state; MPN: 74HC245N,652; OC_FARNELL: 1826788; OC_NEWARK: 71R2268; PACKAGE: DIP-20; SUPPLIER: NXP
U4 = NXP_By_element14_Batch_1:74HC04N,652: Hex inverter; MPN: 74HC04N,652; OC_FARNELL: 1826775; OC_NEWARK: 71R1923; PACKAGE: DIP-14; SUPPLIER: NXP
U5-U15 = NXP_By_element14_Batch_1:74HC373N,652: Octal D-type transparent latch 3-state; MPN: 74HC373N,652; OC_FARNELL: 1826791; OC_NEWARK: 71R2392; PACKAGE: DIP-20; SUPPLIER: NXP
U$1 = JakeBooth:OSCILLATOR
U$2 = JakeBooth:3SWITCH
U$3 = atmel-custom:AT28C256-28DIP: IC EEPROM 256KBIT 150NS 28DIP
U$4 = JakeBooth:HM62256B
U$5 = SparkFun-Connectors:DB15: DB15 / VGA right angle through-hole female connector.
U$6 U$7 = JacobBooth:IDT71256SA